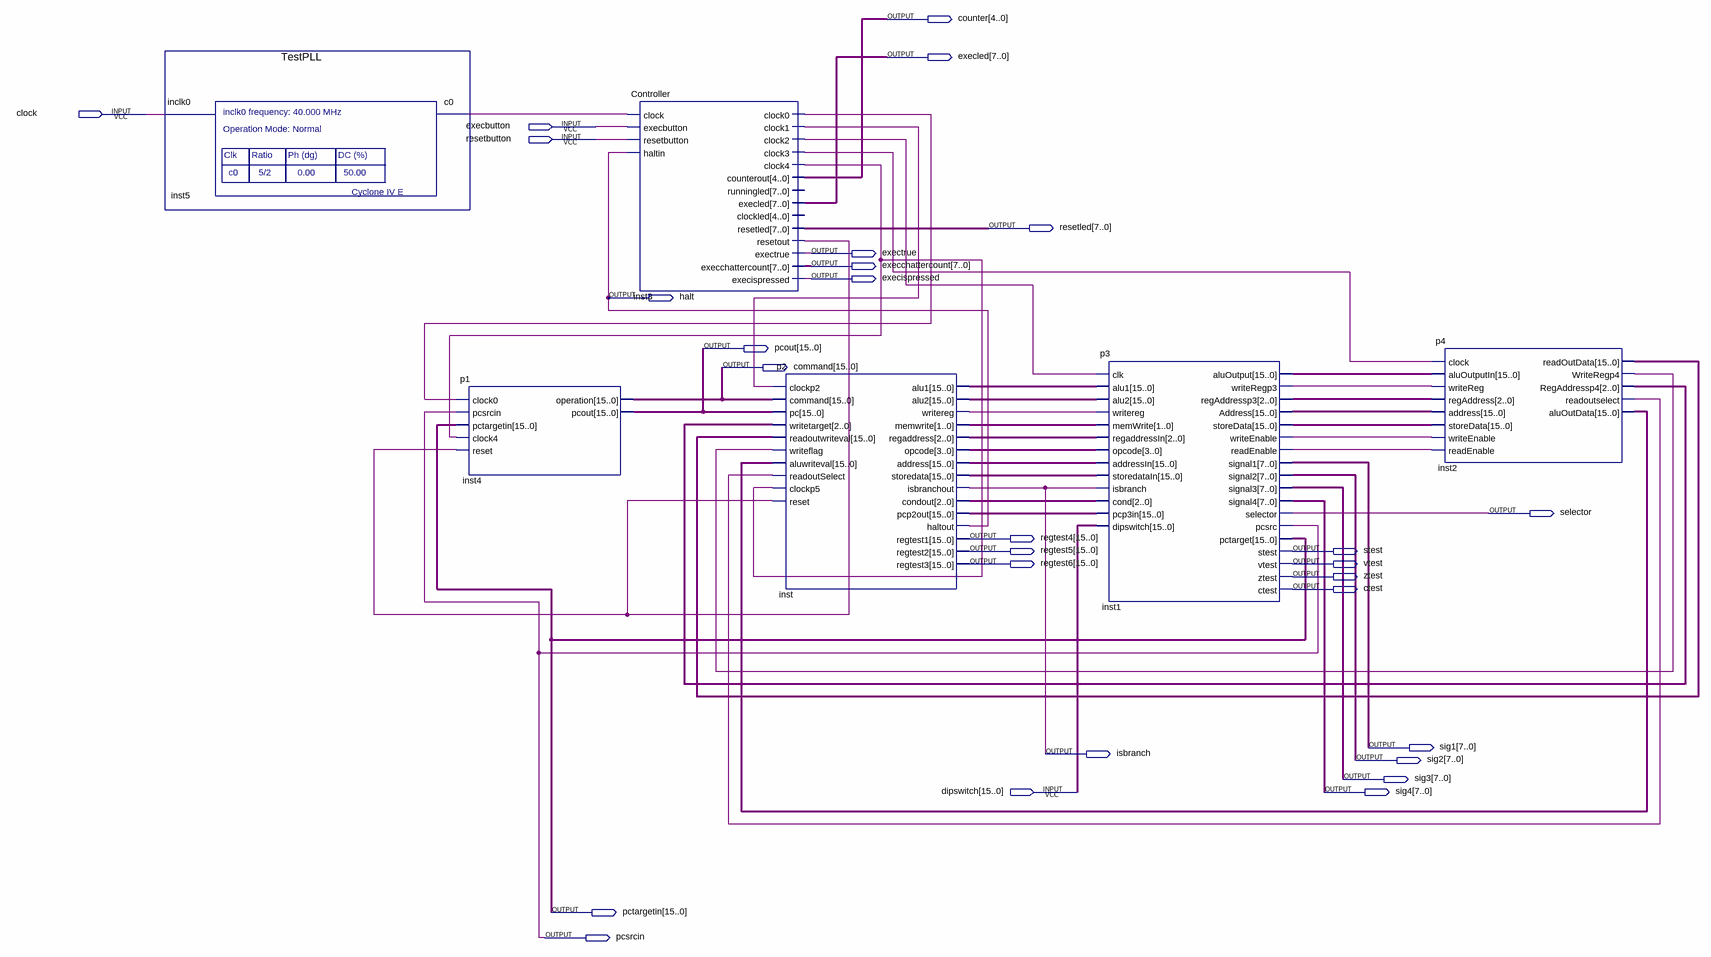
[diagram p0: schematic sheet]
// Quartus schematic main.bdf as structural Verilog: 6 symbols, 28 pins
module main (
  input  clock,
  input  execbutton,
  input  resetbutton,
  input  [15:0] dipswitch,
  output [4:0] counter,
  output [7:0] execled,
  output [7:0] resetled,
  output exectrue,
  output [7:0] execchattercount,
  output execispressed,
  output halt,
  output [15:0] pcout,
  output [15:0] command,
  output selector,
  output [15:0] regtest4,
  output [15:0] regtest5,
  output stest,
  output [15:0] regtest6,
  output vtest,
  output ztest,
  output ctest,
  output [7:0] sig1,
  output isbranch,
  output [7:0] sig2,
  output [7:0] sig3,
  output [7:0] sig4,
  output [15:0] pctargetin,
  output pcsrcin
);

  wire inst1_readenable, inst1_writeenable, inst1_writeregp3, inst2_readoutselect, inst2_writeregp4,
       inst3_clock0, inst3_clock1, inst3_clock2, inst3_clock3, inst3_clock4, inst3_resetout, inst5_c0,
       inst_writereg;
  wire [1:0] inst_memwrite;
  wire [2:0] inst1_regaddressp3, inst2_regaddressp4, inst_condout, inst_regaddress;
  wire [3:0] inst_opcode;
  wire [15:0] inst1_address, inst1_aluoutput, inst1_storedata, inst2_aluoutdata, inst2_readoutdata,
       inst_address, inst_alu1, inst_alu2, inst_pcp2out, inst_storedata;

  TestPLL inst5 (.inclk0(clock), .c0(inst5_c0));
  p1 inst4 (
    .clock0(inst3_clock0), .pcsrcin(pcsrcin), .pctargetin(pctargetin), .clock4(inst3_clock4),
    .reset(inst3_resetout), .operation(command), .pcout(pcout));
  Controller inst3 (
    .clock(inst5_c0), .execbutton(execbutton), .resetbutton(resetbutton), .haltin(halt),
    .clock0(inst3_clock0), .clock1(inst3_clock1), .clock2(inst3_clock2), .clock3(inst3_clock3),
    .clock4(inst3_clock4), .counterout(counter), .execled(execled), .resetled(resetled),
    .resetout(inst3_resetout), .exectrue(exectrue), .execchattercount(execchattercount),
    .execispressed(execispressed));  // open: runningled, clockled
  p2 inst (
    .clockp2(inst3_clock1), .command(command), .pc(pcout), .writetarget(inst2_regaddressp4),
    .readoutwriteval(inst2_readoutdata), .writeflag(inst2_writeregp4), .aluwriteval(inst2_aluoutdata),
    .readoutSelect(inst2_readoutselect), .clockp5(inst3_clock4), .reset(inst3_resetout), .alu1(inst_alu1),
    .alu2(inst_alu2), .writereg(inst_writereg), .memwrite(inst_memwrite), .regaddress(inst_regaddress),
    .opcode(inst_opcode), .address(inst_address), .storedata(inst_storedata), .isbranchout(isbranch),
    .condout(inst_condout), .pcp2out(inst_pcp2out), .haltout(halt), .regtest1(regtest4), .regtest2(regtest5),
    .regtest3(regtest6));
  p3 inst1 (
    .clk(inst3_clock2), .alu1(inst_alu1), .alu2(inst_alu2), .writereg(inst_writereg),
    .memWrite(inst_memwrite), .regaddressIn(inst_regaddress), .opcode(inst_opcode), .addressIn(inst_address),
    .storedataIn(inst_storedata), .isbranch(isbranch), .cond(inst_condout), .pcp3in(inst_pcp2out),
    .dipswitch(dipswitch), .aluOutput(inst1_aluoutput), .writeRegp3(inst1_writeregp3),
    .regAddressp3(inst1_regaddressp3), .Address(inst1_address), .storeData(inst1_storedata),
    .writeEnable(inst1_writeenable), .readEnable(inst1_readenable), .signal1(sig1), .signal2(sig2),
    .signal3(sig3), .signal4(sig4), .selector(selector), .pcsrc(pcsrcin), .pctarget(pctargetin),
    .stest(stest), .vtest(vtest), .ztest(ztest), .ctest(ctest));
  p4 inst2 (
    .clock(inst3_clock3), .aluOutputIn(inst1_aluoutput), .writeReg(inst1_writeregp3),
    .regAddress(inst1_regaddressp3), .address(inst1_address), .storeData(inst1_storedata),
    .writeEnable(inst1_writeenable), .readEnable(inst1_readenable), .readOutData(inst2_readoutdata),
    .WriteRegp4(inst2_writeregp4), .RegAddressp4(inst2_regaddressp4), .readoutselect(inst2_readoutselect),
    .aluOutData(inst2_aluoutdata));
endmodule
